# EAGLE design spider (EAGLE 8.4.2)
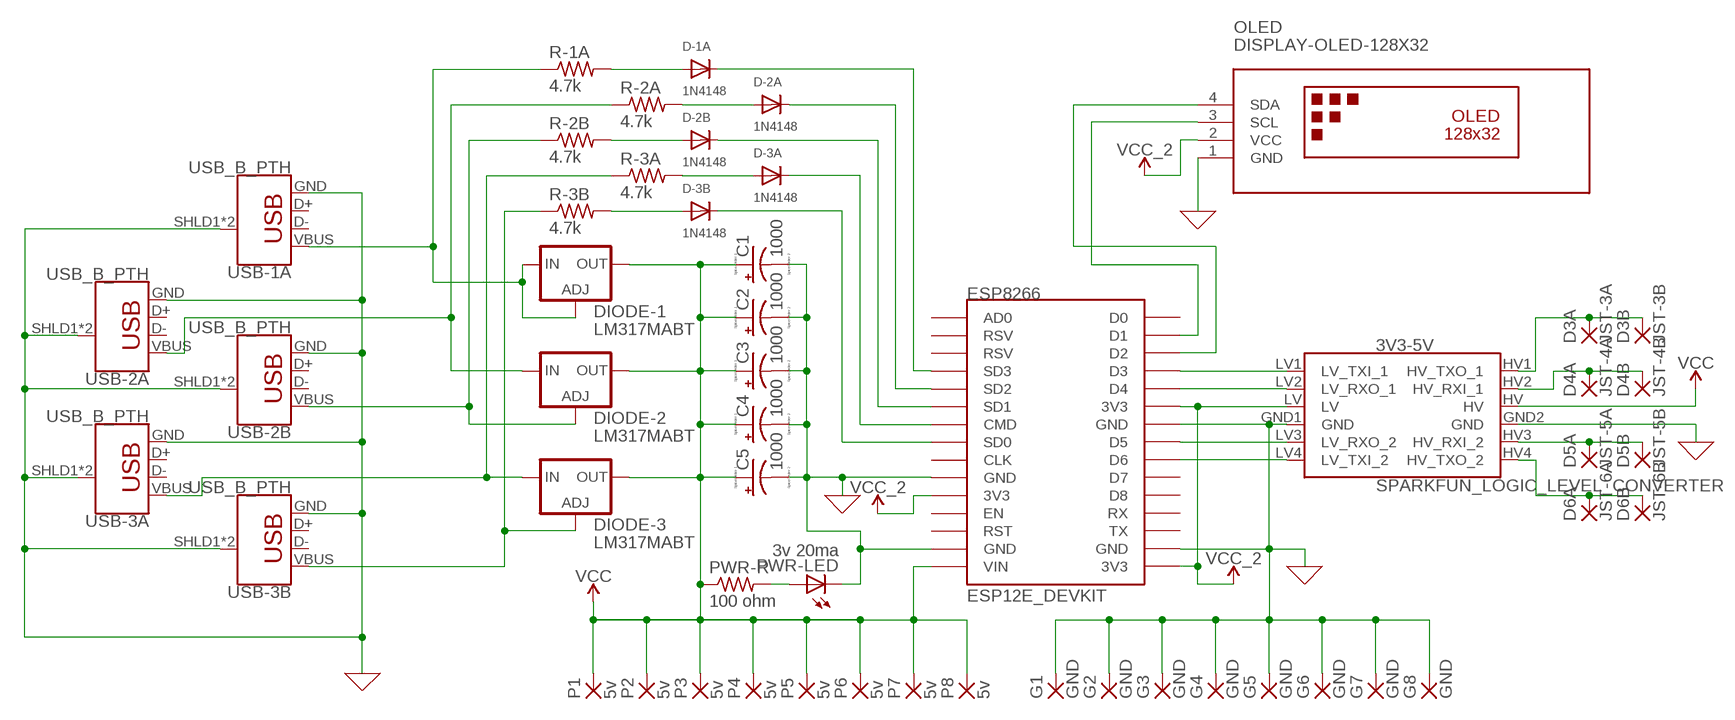
[diagram p0: schematic, sheet 1]

## Parts
3V3-5V  SPARKFUN_LOGIC_LEVEL_CONVERTER  [SPARKFUN_LOGIC_LEVEL_CONVERTER]
C1  1000  CPOL-USE3.5-8  [E3,5-8]
C2  1000  CPOL-USE3.5-8  [E3,5-8]
C3  1000  CPOL-USE3.5-8  [E3,5-8]
C4  1000  CPOL-USE3.5-8  [E3,5-8]
C5  1000  CPOL-USE3.5-8  [E3,5-8]
D3A  JST-3A  2,54/1,1  [2,54/1,1]
D3B  JST-3B  2,54/1,1  [2,54/1,1]
D4A  JST-4A  2,54/1,1  [2,54/1,1]
D4B  JST-4B  2,54/1,1  [2,54/1,1]
D5A  JST-5A  2,54/1,1  [2,54/1,1]
D5B  JST-5B  2,54/1,1  [2,54/1,1]
D6A  JST-6A  2,54/1,1  [2,54/1,1]
D6B  JST-6B  2,54/1,1  [2,54/1,1]
D-1A  1N4148  DIODEDO-1N4148  [DO-1N4148]
D-2A  1N4148  DIODEDO-1N4148  [DO-1N4148]
D-2B  1N4148  DIODEDO-1N4148  [DO-1N4148]
D-3A  1N4148  DIODEDO-1N4148  [DO-1N4148]
D-3B  1N4148  DIODEDO-1N4148  [DO-1N4148]
DIODE-1  LM317MABT  [TO220L1]
DIODE-2  LM317MABT  [TO220L1]
DIODE-3  LM317MABT  [TO220L1]
ESP8266  ESP12E_DEVKIT  [ESP12E_DEVKIT]
G1  GND  2,54/1,1  [2,54/1,1]
G2  GND  2,54/1,1  [2,54/1,1]
G3  GND  2,54/1,1  [2,54/1,1]
G4  GND  2,54/1,1  [2,54/1,1]
G5  GND  2,54/1,1  [2,54/1,1]
G6  GND  2,54/1,1  [2,54/1,1]
G7  GND  2,54/1,1  [2,54/1,1]
G8  GND  2,54/1,1  [2,54/1,1]
OLED  DISPLAY-OLED-128X32  [DISPLAY-OLED-128X32]
P1  5v  2,54/1,1  [2,54/1,1]
P2  5v  2,54/1,1  [2,54/1,1]
P3  5v  2,54/1,1  [2,54/1,1]
P4  5v  2,54/1,1  [2,54/1,1]
P5  5v  2,54/1,1  [2,54/1,1]
P6  5v  2,54/1,1  [2,54/1,1]
P7  5v  2,54/1,1  [2,54/1,1]
P8  5v  2,54/1,1  [2,54/1,1]
PWR-LED  3v 20ma  LED3MM  [LED3MM]
PWR-R  100 ohm  R-US_0204/7  [0204/7]
R-1A  4.7k  R-US_0207/7  [0207/7]
R-2A  4.7k  R-US_0207/7  [0207/7]
R-2B  4.7k  R-US_0207/7  [0207/7]
R-3A  4.7k  R-US_0207/7  [0207/7]
R-3B  4.7k  R-US_0207/7  [0207/7]
USB-1A  USB_B_PTH  [USB-B-PTH]
USB-2A  USB_B_PTH  [USB-B-PTH]
USB-2B  USB_B_PTH  [USB-B-PTH]
USB-3A  USB_B_PTH  [USB-B-PTH]
USB-3B  USB_B_PTH  [USB-B-PTH]

## Nets
3V3: 3V3-5V.LV ESP8266.3V3@0(3V3) ESP8266.3V3@1(3V3) ESP8266.3V3@2(3V3) OLED.2(VCC) ; supply symbol labelled VCC_2
D3-3V: 3V3-5V.LV1(LV_TXI_1) ESP8266.D3
D3-5V: 3V3-5V.HV1(HV_TXO_1) D3A.1(P) D3B.1(P)
D4-3V: 3V3-5V.LV2(LV_RXO_1) ESP8266.D4
D4-5V: 3V3-5V.HV2(HV_RXI_1) D4A.1(P) D4B.1(P)
D5-3V: 3V3-5V.LV3(LV_RXO_2) ESP8266.D5
D5-5V: 3V3-5V.HV3(HV_RXI_2) D5A.1(P) D5B.1(P)
D6-3V: 3V3-5V.LV4(LV_TXI_2) ESP8266.D6
D6-5V: 3V3-5V.HV4(HV_TXO_2) D6A.1(P) D6B.1(P)
GND: 3V3-5V.GND1(GND) 3V3-5V.GND2(GND) C1.- C2.- C3.- C4.- C5.- ESP8266.GND@0(GND) ESP8266.GND@1(GND) ESP8266.GND@2(GND) ESP8266.GND@3(GND) G1.1(P) G2.1(P) G3.1(P) G4.1(P) G5.1(P) G6.1(P) G7.1(P) G8.1(P) OLED.1(GND) PWR-LED.K(C) USB-1A.GND USB-1A.SHLD1(SHIELD) USB-1A.SHLD2(SHIELD) USB-2A.GND USB-2A.SHLD1(SHIELD) USB-2A.SHLD2(SHIELD) USB-2B.GND USB-2B.SHLD1(SHIELD) USB-2B.SHLD2(SHIELD) USB-3A.GND USB-3A.SHLD1(SHIELD) USB-3A.SHLD2(SHIELD) USB-3B.GND USB-3B.SHLD1(SHIELD) USB-3B.SHLD2(SHIELD)
NET-1A: D-1A.A R-1A.2
NET-2A: D-2A.A R-2A.2
NET-2B: D-2B.A R-2B.2
NET-3A: D-3A.A R-3A.2
NET-3B: D-3B.A R-3B.2
OLED-SCL: ESP8266.D1 OLED.3(SCL)
OLED-SDA: ESP8266.D2 OLED.4(SDA)
PWR-LED: PWR-LED.A PWR-R.2
VBUS-1A: DIODE-1.1(ADJ) DIODE-1.3(IN) R-1A.1 USB-1A.VBUS
VBUS-2A: DIODE-2.3(IN) R-2A.1 USB-2A.VBUS
VBUS-2B: DIODE-2.1(ADJ) R-2B.1 USB-2B.VBUS
VBUS-3A: DIODE-3.3(IN) R-3A.1 USB-3A.VBUS
VBUS-3B: DIODE-3.1(ADJ) R-3B.1 USB-3B.VBUS
VCC: 3V3-5V.HV C1.+ C2.+ C3.+ C4.+ C5.+ DIODE-1.2(OUT) DIODE-2.2(OUT) DIODE-3.2(OUT) ESP8266.VIN P1.1(P) P2.1(P) P3.1(P) P4.1(P) P5.1(P) P6.1(P) P7.1(P) P8.1(P) PWR-R.1
VIN-1A: D-1A.C ESP8266.SD3
VIN-2A: D-2A.C ESP8266.SD2
VIN-2B: D-2B.C ESP8266.SD1
VIN-3A: D-3A.C ESP8266.CMD
VIN-3B: D-3B.C ESP8266.SD0
Unconnected: ESP8266.AD0 ESP8266.CLK ESP8266.D0 ESP8266.D7 ESP8266.D8 ESP8266.EN ESP8266.RST ESP8266.RSV@0(RSV) ESP8266.RSV@1(RSV) ESP8266.RX ESP8266.TX USB-1A.D+ USB-1A.D- USB-2A.D+ USB-2A.D- USB-2B.D+ USB-2B.D- USB-3A.D+ USB-3A.D- USB-3B.D+ USB-3B.D-

## Library data of the parts
3V3-5V = SparkFun-Boards:SPARKFUN_LOGIC_LEVEL_CONVERTER: SparkFun Logic Level Converter -Bi-Directional This is the mechnical outline for the 3.3V - 5V bi directional logic level converter. *Note, the "LOCK" Package has the header pins staggered by an offset of 5 mils (off center line), so that when you slide a row of standard 0.1" headers into the PTH pads, it will hold position vertically. See the follwing turorial for more information on this type of special footprints: Sneaky Footprints <https://www.sparkfun.com/tutorials/114> SparkFun Products: SparkFun Logic Level Converter - Bi-Directional <https://www.sparkfun.com/products/12009>
C1-C5 = resistor:CPOL-US: POLARIZED CAPACITOR, American symbol
D3A D3B D4A D4B D5A D5B D6A D6B G1-G8 P1-P8 = wirepad:2,54/1,1: THROUGH-HOLE PAD
D-1A D-2A D-2B D-3A D-3B = adafruit:DIODE: Diode SMADIODE - SMA Surface Mount Package 20V 1A Schottky Diode Digikey: 641-1014-6-ND DO-1N4148 - Through Hole Small Current Diode SOD-123 20V 1 A (.5mV Vf) Schottky Diode - Digikey: MBRX120TPMSCT-ND SOD-323 10V 570mA (.38mV Vf, 3ns) Schottky Diode - Digikey: ZLLS410CT-ND SOD-523 30V 30mA Schottky Diode (RB751S-40TE61) - Digikey: RB751S-40TE61CT-ND SOT23-R/W - SOT23 Package (R = Solder Paste/Reflow Ovens, W = Hand-Soldering) BAT54Film 40V 300mA - Digikey: 497-7162-1-ND
DIODE-1-DIODE-3 = v-reg:LM317?*: 500 mA Adjustable Output Positive Voltage Regulator Source: http://www.onsemi.co.jp .. LM317M-D.PDF
ESP8266 = ESP12E_DEVKIT:ESP12E_DEVKIT: ESP12E DEVKIT BOARD
OLED = diy-modules:DISPLAY-OLED-128X32: 128x32 Dot Matrix OLED Module with I2C interface based on SSD1306 chip More details available here: http://www.tinyosshop.com/index.php?route=product/product&product_id=953 Schematic available here: http://www.tinyosshop.com/datasheet/OLED%2012832.pdf SSD1306 datasheet: https://cdn-shop.adafruit.com/datasheets/SSD1306.pdf Click here to find device on ebay.com <http://www.ebay.com/sch/oled+display+128x32+i2c>
PWR-LED = led:LED: LED OSRAM: - CHIPLED LG R971, LG N971, LY N971, LG Q971, LY Q971, LO R971, LY R971 LH N974, LH R974 LS Q976, LO Q976, LY Q976 LO Q996 - Hyper CHIPLED LW Q18S LB Q993, LB Q99A, LB R99A - SideLED LS A670, LO A670, LY A670, LG A670, LP A670 LB A673, LV A673, LT A673, LW A673 LH A674 LY A675 LS A676, LA A676, LO A676, LY A676, LW A676 LS A679, LY A679, LG A679 - Hyper Micro SIDELED® LS Y876, LA Y876, LO Y876, LY Y876 LT Y87S - SmartLED LW L88C, LW L88S LB L89C, LB L89S, LG L890 LS L89K, LO L89K, LY L89K LS L896, LA L896, LO L896, LY L896 - TOPLED LS T670, LO T670, LY T670, LG T670, LP T670 LSG T670, LSP T670, LSY T670, LOP T670, LYG T670 LG T671, LOG T671, LSG T671 LB T673, LV T673, LT T673, LW T673 LH T674 LS T676, LA T676, LO T676, LY T676, LB T676, LH T676, LSB T676, LW T676 LB T67C, LV T67C, LT T67C, LS T67K, LO T67K, LY T67K, LW E67C LS E67B, LA E67B, LO E67B, LY E67B, LB E67C, LV E67C, LT E67C LW T67C LS T679, LY T679, LG T679 LS T770, LO T770, LY T770, LG T770, LP T770 LB T773, LV T773, LT T773, LW T773 LH T774 LS E675, LA E675, LY E675, LS T675 LS T776, LA T776, LO T776, LY T776, LB T776 LHGB T686 LT T68C, LB T68C - Hyper Mini TOPLED® LB M676 - Mini TOPLED Santana® LG M470 LS M47K, LO M47K, LY M47K Source: http://www.osram.convergy.de LUXEON: - LUMILED® LXK2-PW12-R00, LXK2-PW12-S00, LXK2-PW14-U00, LXK2-PW14-V00 LXK2-PM12-R00, LXK2-PM12-S00, LXK2-PM14-U00 LXK2-PE12-Q00, LXK2-PE12-R00, LXK2-PE12-S00, LXK2-PE14-T00, LXK2-PE14-U00 LXK2-PB12-K00, LXK2-PB12-L00, LXK2-PB12-M00, LXK2-PB14-N00, LXK2-PB14-P00, LXK2-PB14-Q00 LXK2-PR12-L00, LXK2-PR12-M00, LXK2-PR14-Q00, LXK2-PR14-R00 LXK2-PD12-Q00, LXK2-PD12-R00, LXK2-PD12-S00 LXK2-PH12-R00, LXK2-PH12-S00 LXK2-PL12-P00, LXK2-PL12-Q00, LXK2-PL12-R00 Source: www.luxeon.com KINGBRIGHT: KA-3528ASYC Source: www.kingbright.com
PWR-R R-1A R-2A R-2B R-3A R-3B = resistor:R-US_: RESISTOR, American symbol
USB-1A USB-2A USB-2B USB-3A USB-3B = SparkFun-Connectors:USB_B: USB Type B Connector SparkFun Products: SparkFun Stepoko <https://www.sparkfun.com/products/13899> PTH; PROD_ID: CONN-08278; SF_ID: PRT-00139

## Board
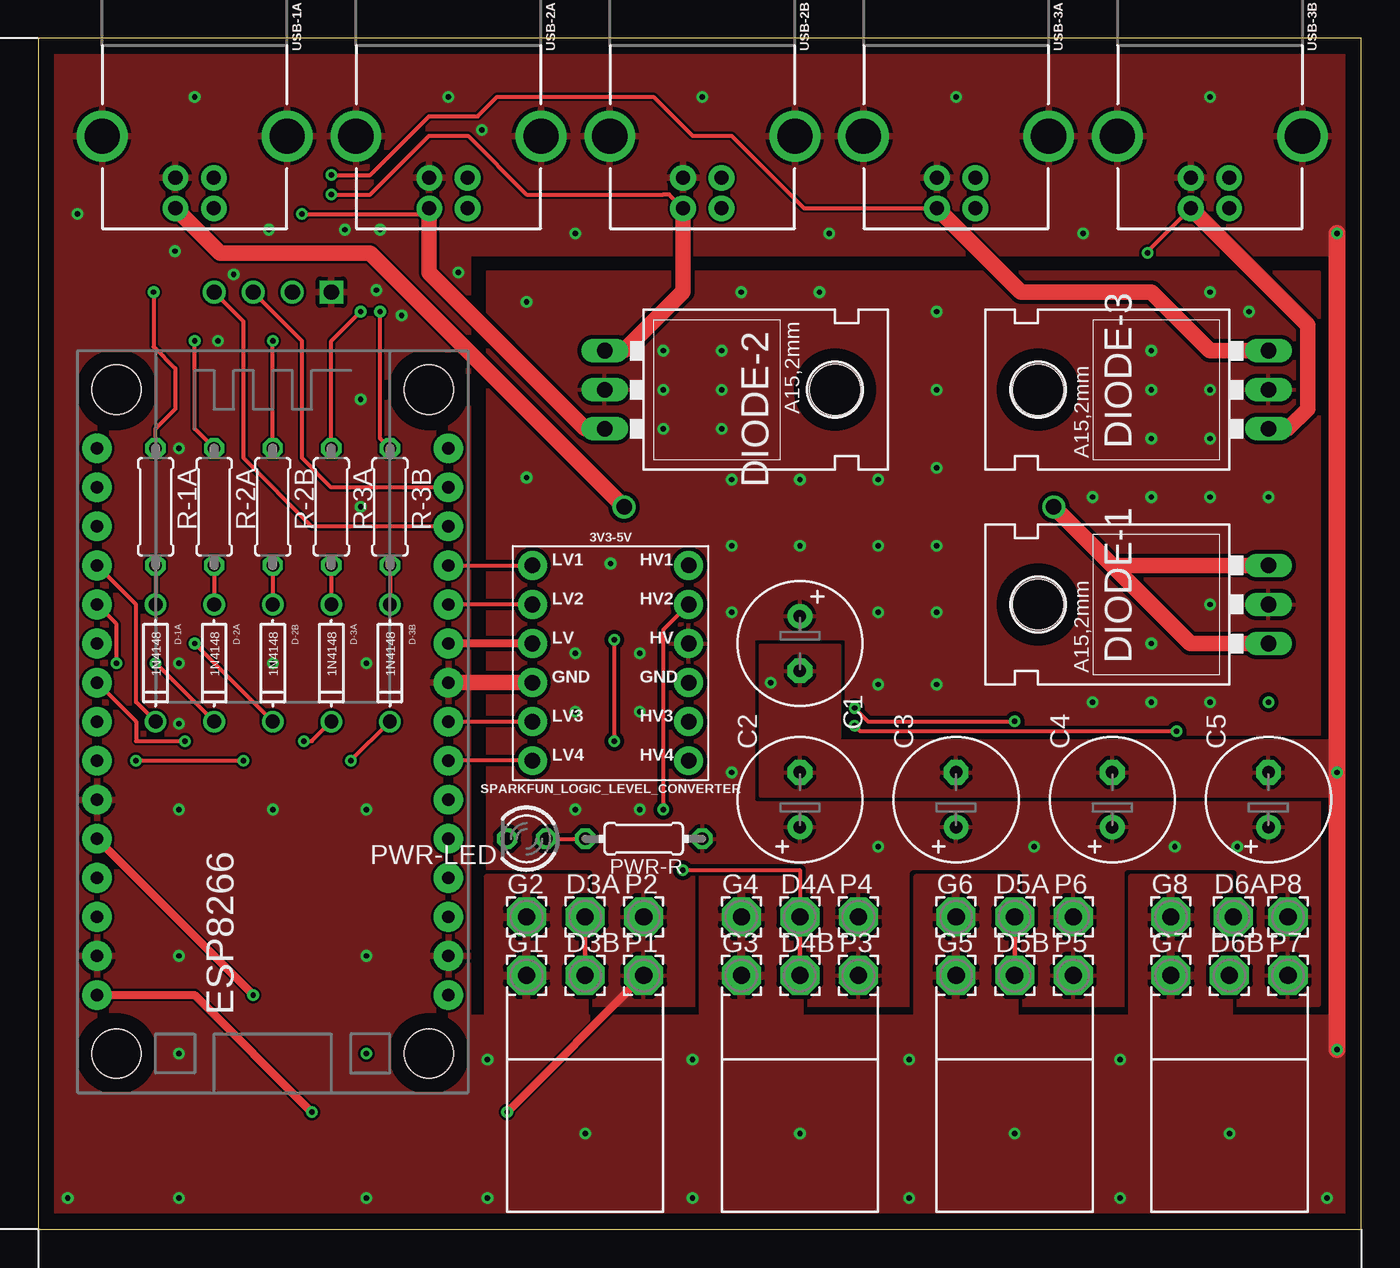
[diagram p1: board, top side]
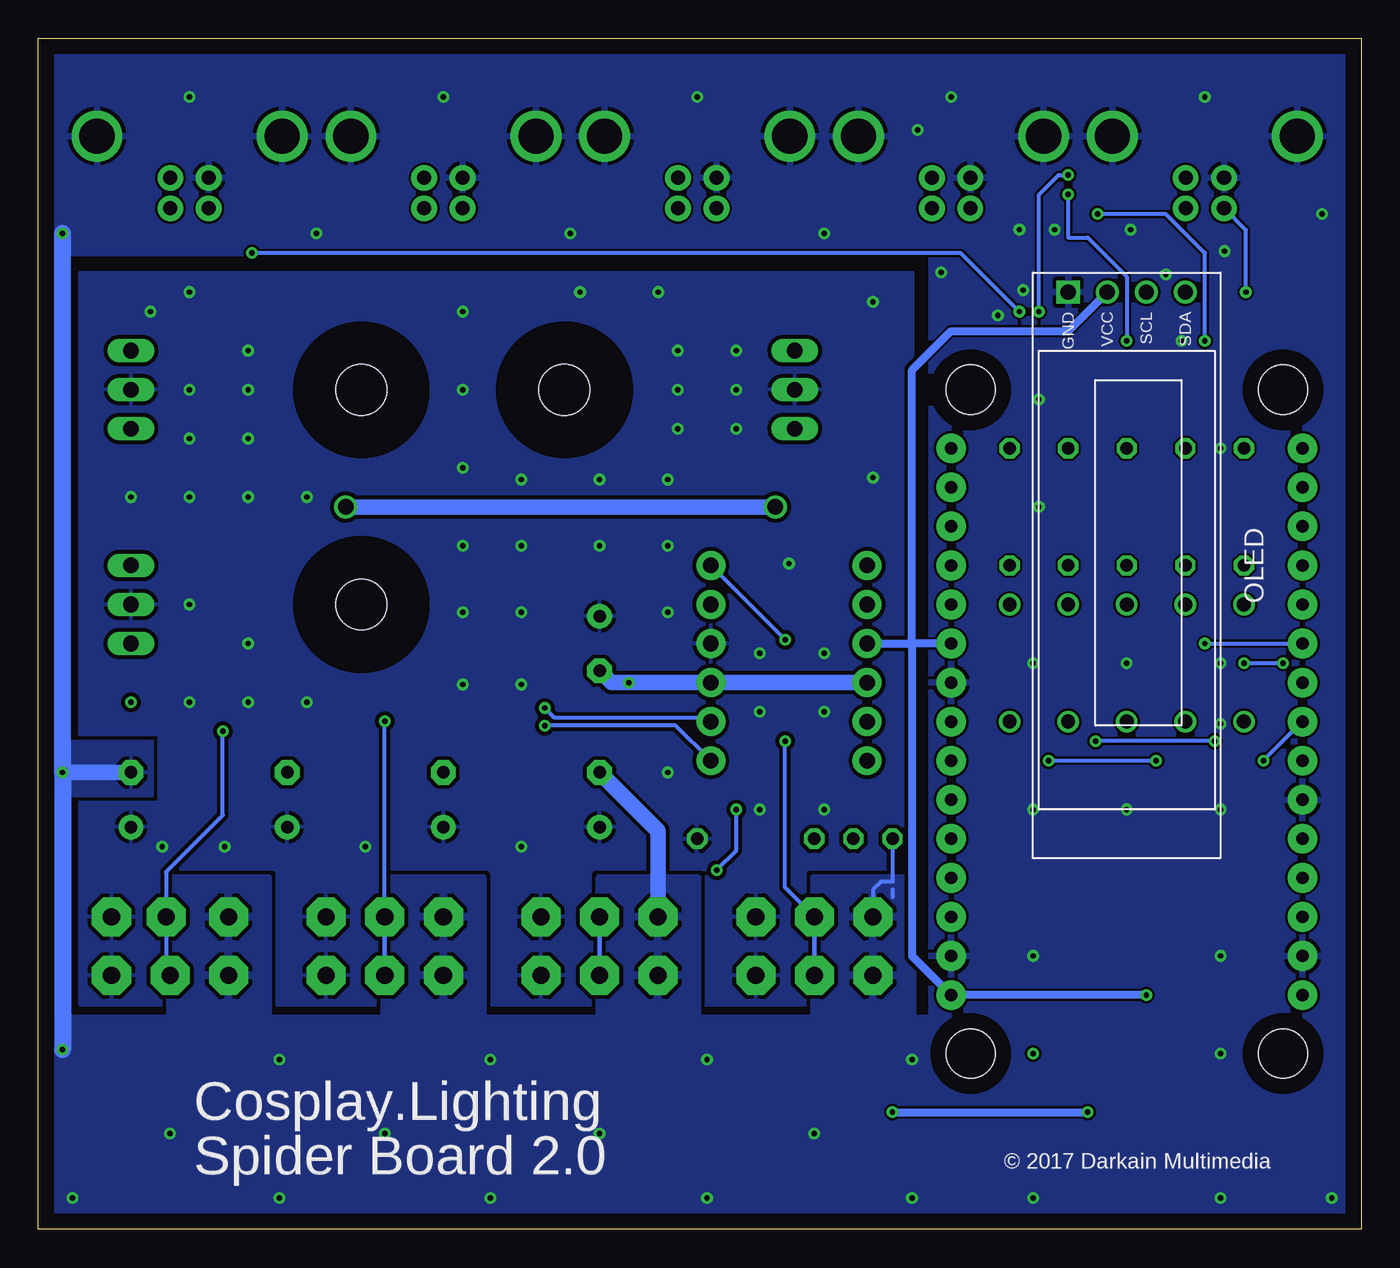
[diagram p2: board, bottom side, seen from below]

Size 86.03 x 77.46 mm. Coordinates in mm from the lower left corner, seen from the top.
Outline: 0,0 86.03,0 86.03,77.46 0,77.46 0,0
Copper layers (1*16): Top 0.035mm / dielectric 1.5mm / Bottom 0.035mm
Design rules "default *": minimum track width 6mil, minimum drill 0.35mm, track to track 6mil, track to pad 6mil, pad to pad 6mil, via to via 6mil, smd to smd 6mil, copper to edge 40mil, drill to drill 13mil, minimum pad ring 10mil, minimum via ring 8mil, stop-mask expansion 4mil, vias tented up to drill 14mil, thermal gap 10mil

### Footprints (pad centres in the part's own frame; a part is rotated, then mirrored left to right if it is on the bottom)
SPARKFUN_LOGIC_LEVEL_CONVERTER = drill 1.016 pad 1.88: GND1 -5.08,-1.27; GND2 5.08,-1.27; HV 5.08,1.27; HV1 5.08,6.35; HV2 5.08,3.81; HV3 5.08,-3.81; HV4 5.08,-6.35; LV -5.08,1.27; LV1 -5.08,6.35; LV2 -5.08,3.81; LV3 -5.08,-3.81; LV4 -5.08,-6.35
E3,5-8 = drill 0.813 pad 1.6: + -1.778,0 | drill 0.813 pad 1.6 octagon: - 1.778,0
2,54/1,1 = drill 1.118 pad 2.54 octagon: 1 0,0
DO-1N4148 = drill 0.9: A -3.81,0; C 3.81,0
TO220L1 = drill 1.016 long: 1 -2.54,-3.81; 2 0,-3.81; 3 2.54,-3.81 | hole 3.302: 0,11.176
ESP12E_DEVKIT = drill 0.8 pad 1.93: 3V3@0 -11.43,-7.62; 3V3@1 11.43,5.08; 3V3@2 11.43,-17.78; AD0 -11.43,17.78; CLK -11.43,-2.54; CMD -11.43,2.54; D0 11.43,17.78; D1 11.43,15.24; D2 11.43,12.7; D3 11.43,10.16; D4 11.43,7.62; D5 11.43,0; D6 11.43,-2.54; D7 11.43,-5.08; D8 11.43,-7.62; EN -11.43,-10.16; GND@0 -11.43,-5.08; GND@1 -11.43,-15.24; GND@2 11.43,2.54; GND@3 11.43,-15.24; RST -11.43,-12.7; RSV@0 -11.43,15.24; RSV@1 -11.43,12.7; RX 11.43,-10.16; SD0 -11.43,0; SD1 -11.43,5.08; SD2 -11.43,7.62; SD3 -11.43,10.16; TX 11.43,-12.7; VIN -11.43,-17.78 | hole 3.2: -10.16,21.59; 10.16,21.59; 10.16,-21.59; -10.16,-21.59
DISPLAY-OLED-128X32 = drill 1 square: 1 -17.78,-3.81 | drill 1: 2 -17.78,-1.27; 3 -17.78,1.27; 4 -17.78,3.81
LED3MM = drill 0.813 octagon: A -1.27,0; K 1.27,0
0204/7 = drill 0.813 octagon: 1 -3.81,0; 2 3.81,0
0207/7 = drill 0.813 octagon: 1 -3.81,0; 2 3.81,0
USB-B-PTH = drill 0.914 pad 1.676: D+ 4,1.25; D- 5.981,1.25; GND 4,-1.25; VBUS 5.981,-1.25 | drill 2.286: SHLD1 1.282,-6.02; SHLD2 1.282,6.02

### Placement (x,y rotation side)
3V3-5V  37.21,36.83 0 top
C1  49.53,38.1 270 top
C2  49.53,27.94 90 top
C3  59.69,27.94 90 top
C4  69.85,27.94 90 top
C5  80.01,27.94 90 top
D3A  35.56,20.32 0 top
D3B  35.56,16.51 0 top
D4A  49.53,20.32 0 top
D4B  49.53,16.51 0 top
D5A  63.5,20.32 0 top
D5B  63.5,16.51 0 top
D6A  77.72,20.32 0 top
D6B  77.47,16.51 0 top
D-1A  7.62,36.83 270 top
D-2A  11.43,36.83 270 top
D-2B  15.24,36.83 270 top
D-3A  19.05,36.83 270 top
D-3B  22.86,36.83 270 top
DIODE-1  76.2,40.64 90 top
DIODE-2  40.64,54.61 270 top
DIODE-3  76.2,54.61 90 top
ESP8266  15.24,33.02 0 top
G1  31.75,16.51 0 top
G2  31.75,20.32 0 top
G3  45.72,16.51 0 top
G4  45.72,20.32 0 top
G5  59.69,16.51 0 top
G6  59.69,20.32 0 top
G7  73.66,16.51 0 top
G8  73.66,20.32 0 top
OLED  15.24,43.18 270 bottom
P1  39.37,16.51 0 top
P2  39.37,20.32 0 top
P3  53.34,16.51 0 top
P4  53.34,20.32 0 top
P5  67.31,16.51 0 top
P6  67.31,20.32 0 top
P7  81.28,16.51 0 top
P8  81.28,20.32 0 top
PWR-LED  31.75,25.4 180 top
PWR-R  39.37,25.4 180 top
R-1A  7.62,46.99 270 top
R-2A  11.43,46.99 270 top
R-2B  15.24,46.99 270 top
R-3A  19.05,46.99 270 top
R-3B  22.86,46.99 270 top
USB-1A  10.16,72.39 270 top
USB-2A  26.67,72.39 270 top
USB-2B  43.18,72.39 270 top
USB-3A  59.69,72.39 270 top
USB-3B  76.2,72.39 270 top

### Tracks (layer width: path | path; a pad name or v marks a point on that pad's centre or on a via)
3V3  (via drill 0.35)
  Top 0.508: ESP8266.3V3@0 v13.97,15.24 | 3V3-5V.LV ESP8266.3V3@1
  Bottom 0.508: 29.21,38.1 29.21,17.78 ESP8266.3V3@2 v13.97,15.24 | 29.21,38.1 29.21,55.88 26.67,58.42 19.05,58.42 OLED.2 | 3V3-5V.LV 29.21,38.1 | ESP8266.3V3@1 29.21,38.1
D3-3V
  Top 0.254: ESP8266.D3 3V3-5V.LV1
D3-5V  (via drill 0.35)
  Top 0.254: v37.47,31.75 v37.47,38.35
  Top 0.305: D3A.1 D3B.1
  Bottom 0.254: D3A.1 37.47,22.23 v37.47,31.75 | 3V3-5V.HV1 v37.47,38.35
  Bottom 0.305: D3B.1 D3A.1
D4-3V
  Top 0.254: 3V3-5V.LV2 ESP8266.D4
D4-5V  (via drill 0.35)
  Top 0.254: 3V3-5V.HV2 40.64,38.99 v40.64,27.3 | 49.53,19.81 49.53,23.37 v41.91,23.37
  Top 0.305: D4A.1 49.53,19.81 D4B.1
  Bottom 0.254: v40.64,27.3 40.64,24.64 v41.91,23.37
  Bottom 0.305: D4B.1 D4A.1
D5-3V
  Top 0.254: ESP8266.D5 3V3-5V.LV3
D5-5V  (via drill 0.35)
  Top 0.254: v53.09,33.91 53.95,33.04 v63.5,33.04
  Top 0.305: D5A.1 D5B.1
  Bottom 0.254: D5A.1 v63.5,33.04 | v53.09,33.91 52.45,33.27 42.55,33.27 3V3-5V.HV3
  Bottom 0.305: D5B.1 D5A.1
D6-3V
  Top 0.254: 3V3-5V.LV4 ESP8266.D6
D6-5V  (via drill 0.35)
  Top 0.254: v53.09,32.77 53.47,32.38 v74.04,32.38
  Bottom 0.254: 3V3-5V.HV4 44.58,32.77 v53.09,32.77 | v74.04,32.38 74.04,26.92 77.72,23.24 D6A.1 77.72,16.76 D6B.1
GND  (via drill 0.35)
  Top 1.016: 3V3-5V.GND1 ESP8266.GND@2
  Top 1.118: v84.45,64.77 v84.45,29.72 v84.45,11.68
  Bottom 0.254: 30.48,22.1 30.48,21.59 | PWR-LED.K 30.48,22.61 31.24,22.61 31.75,22.1 G2.1
  Bottom 1.016: 3V3-5V.GND1 3V3-5V.GND2 v47.62,35.56 48.77,35.56 C1.- | C2.- 45.72,25.91 G4.1 | C5.- v84.45,29.72
  Bottom 1.118: v84.45,64.77 v84.45,29.72 v84.45,11.68
  other vias: 21.34,17.78 9.14,17.78 9.14,27.3 21.34,27.3 9.14,50.8 10.16,73.66 26.67,73.66 43.18,73.66 59.69,73.66 76.2,73.66 9.14,11.43 9.14,36.83 21.34,36.83 29.21,11.05 67.94,64.77 51.44,64.77 34.92,64.77 2.54,66.04 19.94,65.02 20.95,53.98 20.95,46.99 22.23,65.02 42.55,11.05 9.14,32.89 23.62,59.44 28.83,71.5 14.99,65.02 12.7,62.1 8.89,63.63 21.97,61.09 11.68,57.78 56.64,11.05 70.36,11.05 1.91,2.03 9.14,2.03 21.34,2.03 29.21,2.03 42.55,2.03 56.64,2.03 70.36,2.03 83.82,2.03 27.3,62.23 35.56,6.22 49.53,6.22 63.5,6.22 77.47,6.22 15.24,27.3 15.24,36.83
  pour Top: 86.36,77.47 0,77.47 0,0 27.94,0 27.94,63.5 86.36,63.5
  pour Bottom: 86.36,77.47 0,77.47 0,0 27.94,0 27.94,63.5 86.36,63.5
  pour Top: 26.67,13.72 86.36,13.72 86.36,0 26.67,0
  pour Bottom: 86.36,13.72 26.67,13.72 26.67,0 86.36,0
  pour Bottom (isolate 0.254, rank 3): 49.53,22.86 43.18,22.86 43.18,12.7 49.53,12.7
  pour Top (isolate 0.254, rank 3): 77.47,22.86 71.12,22.86 71.12,12.7 77.47,12.7
  pour Bottom (isolate 0.254, rank 3): 77.47,22.86 71.12,22.86 71.12,12.7 77.47,12.7
  pour Top (isolate 0.254, rank 3): 63.5,22.86 57.15,22.86 57.15,12.7 63.5,12.7
  pour Bottom (isolate 0.254, rank 3): 63.5,22.86 57.15,22.86 57.15,12.7 63.5,12.7
  pour Top (isolate 0.254, rank 3): 49.53,22.86 43.18,22.86 43.18,12.7 49.53,12.7
  pour Top (isolate 0.254, rank 4): 35.56,22.86 29.21,22.86 29.21,12.7 35.56,12.7
  pour Bottom (isolate 0.254, rank 3): 35.56,22.86 29.21,22.86 29.21,12.7 35.56,12.7
  pour Top (isolate 0.254): 46.99,37.97 52.07,37.97 52.07,31.75 85.09,31.75 85.09,28.19 46.99,28.19
  pour Bottom: 85.85,31.75 78.61,31.75 78.61,28.19 85.85,28.19
N$1  (via drill 0.35)
  other vias: 21.34,11.43
N$4  (via drill 0.35)
  other vias: 80.01,34.29
NET-1A
  Top 0.254: R-1A.2 D-1A.A
NET-2A
  Top 0.254: R-2A.2 D-2A.A
NET-2B
  Top 0.254: R-2B.2 D-2B.A
NET-3A
  Top 0.254: R-3A.2 D-3A.A
NET-3B
  Top 0.254: R-3B.2 D-3B.A
OLED-SCL
  Top 0.254: OLED.3 17.14,57.78 17.14,50.16 19.05,48.26 ESP8266.D1
OLED-SDA
  Top 0.254: ESP8266.D2 17.78,45.72 13.34,50.16 13.34,59.05 OLED.4
PWR-LED
  Top 0.254: PWR-LED.A PWR-R.2
VBUS-1A  (via drill 0.35, 1)
  Top 0.254: R-1A.1 7.62,52.07 8.91,53.36 8.91,55.99 7.49,57.4 v7.49,60.96
  Top 1.016: 69.85,43.18 v66.04,46.99 | 69.85,43.18 74.93,38.1 DIODE-1.1 | v38.1,46.99 21.59,63.5 11.82,63.5 USB-1A.VBUS | DIODE-1.3 69.85,43.18
  Bottom 0.254: v7.49,60.96 7.49,64.99 USB-1A.VBUS
  Bottom 1.016: v38.1,46.99 v66.04,46.99
VBUS-2A  (via drill 0.35)
  Top 0.254: R-2A.1 10.16,52.07 v10.16,57.78 | v17.14,66.04 25.4,66.04
  Top 1.016: DIODE-2.3 35.56,52.07 25.4,62.23 25.4,65.02 | 25.4,66.04 25.4,65.02 | 25.4,65.02 25.42,65.04 USB-2A.VBUS
  Bottom 0.254: v17.14,66.04 12.7,66.04 10.16,63.5 v10.16,57.78
VBUS-2B  (via drill 0.35)
  Top 0.254: R-2B.1 v15.24,57.78 | v19.05,67.31 21.59,67.31 25.4,71.12 27.94,71.12 31.75,67.31 40.64,67.31 41.03,67.31 USB-2B.VBUS 41.54,66.41
  Top 1.016: DIODE-2.1 38.1,57.15 41.93,60.98 USB-2B.VBUS
  Bottom 0.254: v19.05,67.31 19.05,64.52 17.78,64.52 15.24,61.98 v15.24,57.78
VBUS-3A  (via drill 0.35)
  Top 0.254: R-3A.1 19.05,57.78 v20.95,59.69 | v19.05,68.58 21.59,68.58 25.4,72.39 28.57,72.39 29.84,73.66 40.01,73.66 42.55,71.12 45.09,71.12 49.8,66.41 USB-3A.VBUS
  Top 1.016: DIODE-3.3 76.2,57.15 72.39,60.96 63.89,60.96 USB-3A.VBUS
  Bottom 0.254: v20.95,59.69 20.95,67.31 19.68,68.58 v19.05,68.58
VBUS-3B  (via drill 0.35)
  Top 0.254: R-3B.1 22.23,51.44 v22.23,59.69 | v72.14,63.5 72.04,63.5 USB-3B.VBUS
  Top 1.016: DIODE-3.1 81.28,52.07 82.55,53.34 82.55,58.81 USB-3B.VBUS
  Bottom 0.254: v22.23,59.69 26.04,63.5 v72.14,63.5
VCC  (via drill 0.35)
  Top 0.508: ESP8266.VIN 10.16,15.24 v17.78,7.62 | P1.1 v30.48,7.62
  Bottom 0.508: v30.48,7.62 v17.78,7.62
  other vias: 34.92,33.66 34.92,37.47 45.09,44.45 39.12,37.47 39.12,33.66 31.75,48.9 49.53,44.45 54.61,44.45 58.42,44.45 54.61,40.13 58.42,40.13 80.01,47.62 72.39,38.1 76.2,40.64 76.2,47.62 72.39,47.62 68.58,47.62 72.39,51.44 76.2,51.44 72.39,54.61 72.39,57.15 76.2,54.61 58.42,49.53 58.42,54.61 58.42,59.69 50.8,60.96 45.72,60.96 76.2,60.96 78.74,59.69 40.64,52.07 40.64,54.61 40.64,57.15 44.45,57.15 44.45,54.61 44.45,52.07 31.75,60.33 37.21,43.31 39.12,27.3 34.92,27.3 45.09,48.77 49.53,48.77 54.61,48.77 54.61,35.43 58.42,35.43 68.58,34.29 72.39,34.29 76.2,34.29 54.61,24.89 64.77,24.89 73.91,24.89 77.98,24.89 45.09,40.13 45.09,29.72
  pour Bottom (isolate 0.254, rank 6): 29.21,62.23 29.21,14.61 83.31,14.61 83.31,62.23
  pour Top (isolate 0.254, rank 6): 29.21,62.23 29.21,14.61 83.31,14.61 83.31,62.23
VIN-1A
  Top 0.254: D-1A.C 6.35,34.29 6.35,40.64 ESP8266.SD3
VIN-2A  (via drill 0.35)
  Top 0.254: v5.08,36.83 5.08,39.37 ESP8266.SD2 | v7.62,36.83 D-2A.C
  Bottom 0.254: v7.62,36.83 v5.08,36.83
VIN-2B  (via drill 0.35)
  Top 0.254: D-2B.C v10.16,38.1
  Bottom 0.254: v10.16,38.1 ESP8266.SD1
VIN-3A  (via drill 0.35)
  Top 0.254: ESP8266.CMD 6.35,33.02 6.35,31.75 v9.53,31.75 | v17.27,31.75 17.78,31.75 D-3A.C
  Bottom 0.254: v9.53,31.75 v17.27,31.75
VIN-3B  (via drill 0.35)
  Top 0.254: v6.35,30.48 v13.34,30.48 | v20.32,30.48 D-3B.C
  Bottom 0.254: v20.32,30.48 v13.34,30.48 | v6.35,30.48 ESP8266.SD0

### Text on the board
bPlace: © 2017 Darkain Multimedia | Cosplay.Lighting / Spider Board 2.0